# EAGLE design Potential DividerPCB (EAGLE 9.6.2)
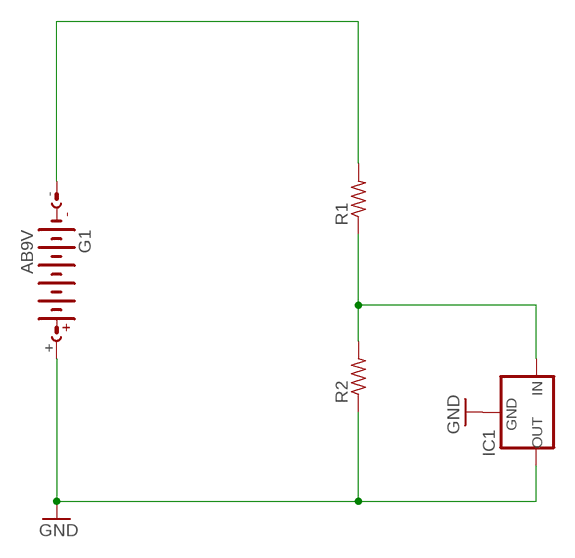
[diagram p0: schematic, sheet 1]

## Parts
G1  AB9V  [AB9V]
IC1  78LXX  [78LXX]
R1  R-US_R0805  [R0805]
R2  R-US_R0805  [R0805]

## Nets
GND: G1.+ IC1.GND IC1.OUT R2.1
N$1: G1.- R1.2
N$3: IC1.IN R1.1 R2.2

## Library data of the parts
G1 = battery:AB9V: 9-V BATTERY CLIP
IC1 = v-reg:78LXX: VOLTAGE REGULATOR
R1 R2 = rcl:R-US_: RESISTOR, American symbol; SPICEPREFIX: R

## Board
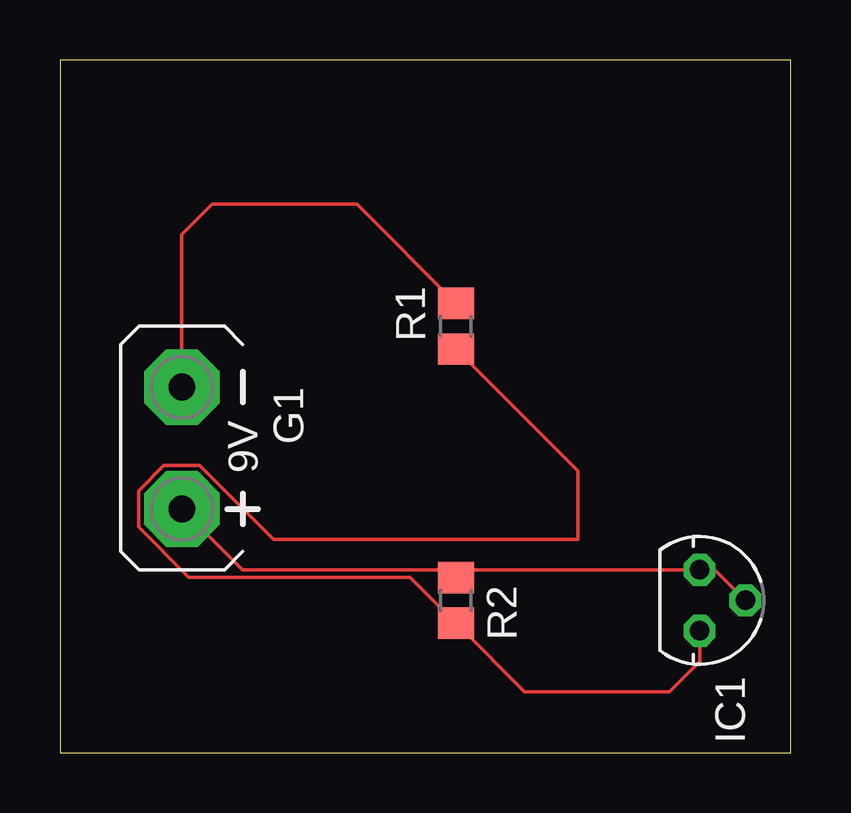
[diagram p1: board, top side]

Size 30.46 x 28.88 mm. Coordinates in mm from the lower left corner, seen from the top.
Outline: 0,0 30.46,0 30.46,28.88 0,28.88 0,0
Copper layers (1*16): Top 0.035mm / dielectric 1.5mm / Bottom 0.035mm
Design rules "default": minimum track width 6mil, minimum drill 0.35mm, track to track 6mil, track to pad 6mil, pad to pad 6mil, via to via 6mil, smd to smd 6mil, copper to edge 40mil, drill to drill 6mil, minimum pad ring 10mil, minimum via ring 8mil, stop-mask expansion 4mil, vias tented up to drill 0mil, thermal gap 10mil

### Footprints (pad centres in the part's own frame; a part is rotated, then mirrored left to right if it is on the bottom)
AB9V = drill 1.118 pad 3.15 octagon: + 0,2.54; - 0,-2.54
78LXX = drill 0.813 octagon: GND 0,1.905; IN 1.27,0; OUT -1.27,0
R0805 = smd 1.3 x 1.5: 1 -0.95,0; 2 0.95,0

### Placement (x,y rotation side)
G1  5.08,12.7 180 top
IC1  26.67,6.35 270 top
R1  16.51,17.78 90 top
R2  16.51,6.35 270 top

### Tracks (layer width: path | path; a pad name or v marks a point on that pad's centre or on a via)
GND
  Top 0.152: G1.+ 7.62,7.62 16.19,7.62 R2.1 16.83,7.62 IC1.OUT 27.3,7.62 IC1.GND
N$1
  Top 0.152: G1.- 5.08,21.59 6.35,22.86 12.38,22.86 R1.2
N$3
  Top 0.152: IC1.IN 26.67,3.81 25.4,2.54 19.37,2.54 16.67,5.24 R2.2 14.59,7.31 5.37,7.31 3.28,9.41 3.28,10.91 4.33,11.96 5.83,11.96 8.9,8.89 21.59,8.89 21.59,11.75 R1.1